# EAGLE schematic structure_right (EAGLE 9.4.2)
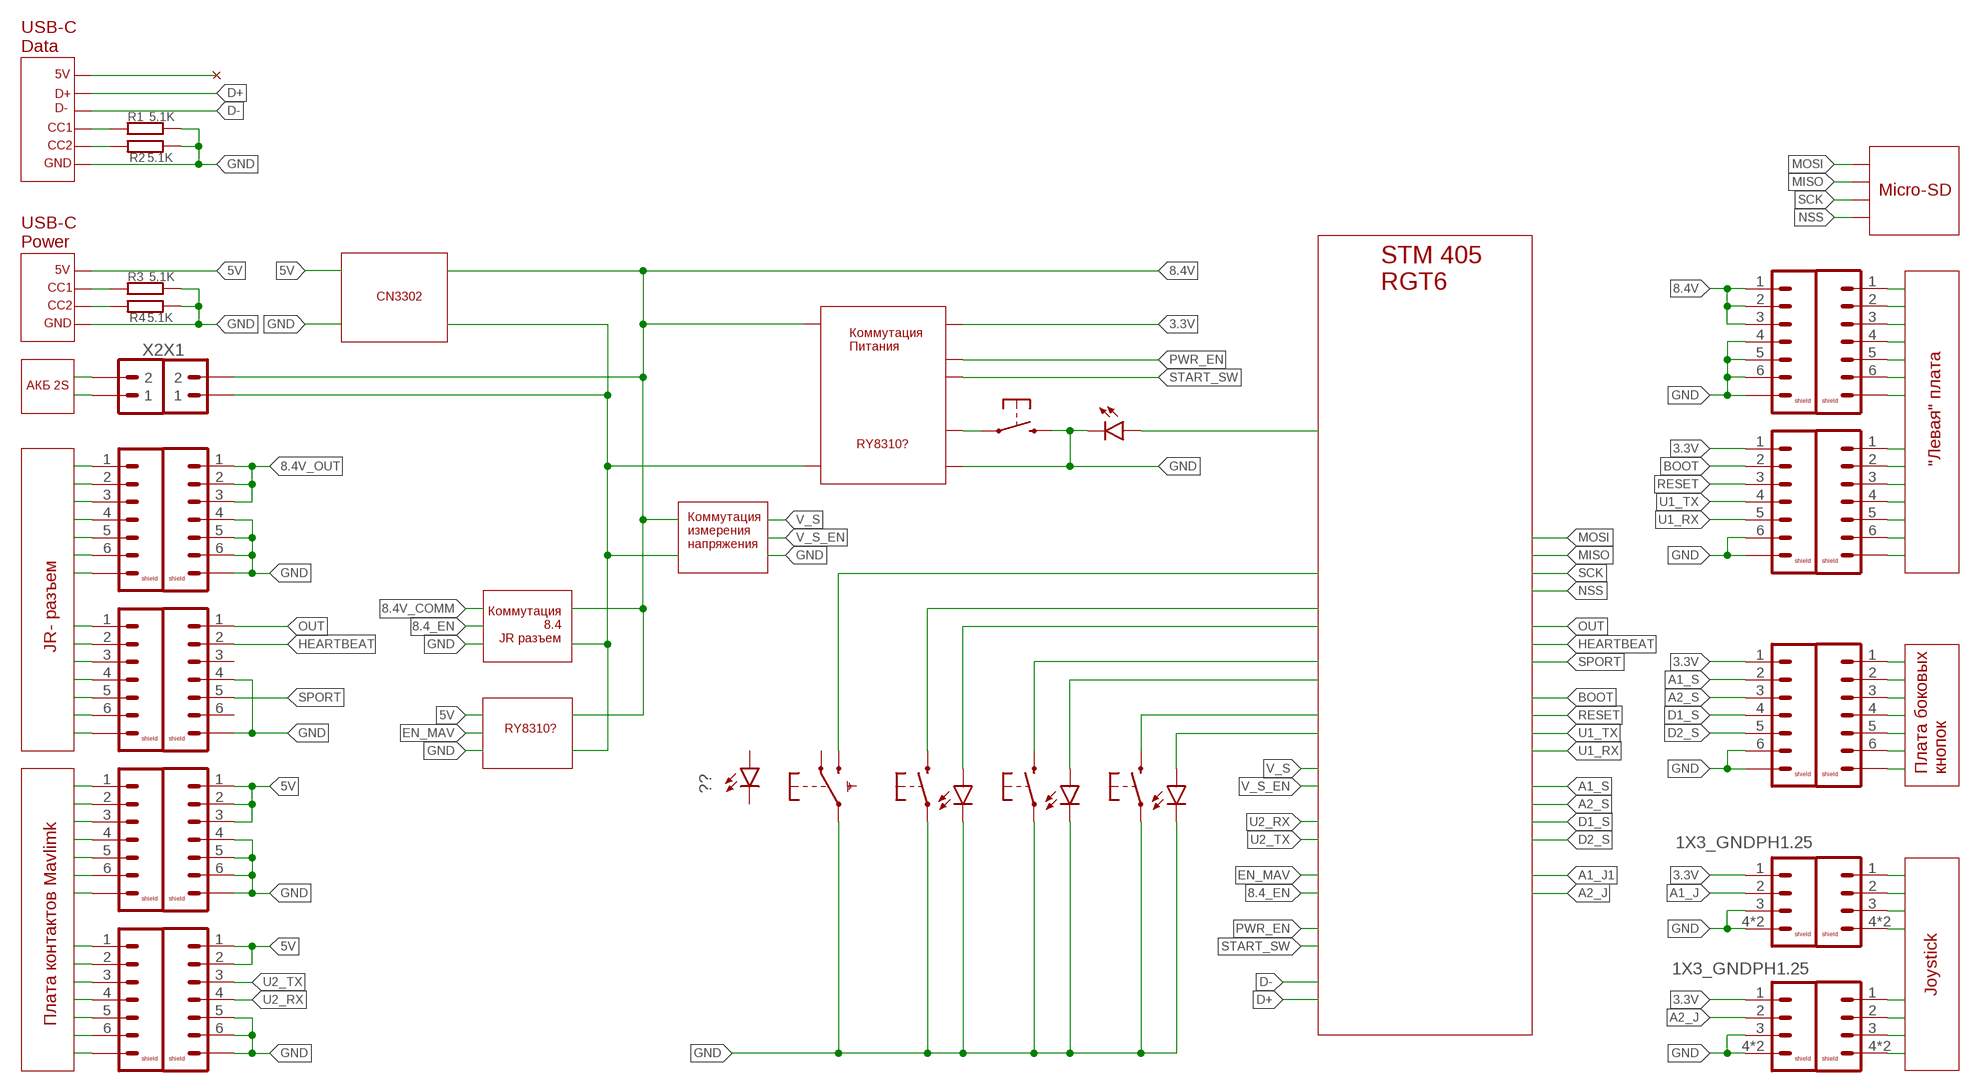
[diagram p0: schematic, sheet 1]

## Parts
LED1  LED1608  [0603]
LED2  LED1608  [0603]
LED3  LED1608  [0603]
LED5  ??  LED1608  [0603]
LED6  LED1608  [0603]
R1  5.1K  R0603_SMALL  [0603_SMALL]
R2  5.1K  R0603_SMALL  [0603_SMALL]
R3  5.1K  R0603_SMALL  [0603_SMALL]
R4  5.1K  R0603_SMALL  [0603_SMALL]
S2  BUTTON1  [3X4X2]
S3  SS12D07VG  [SS12D07VG...]
S4  BUTTON1  [3X4X2]
S5  BUTTON1  [3X4X2]
S6  BUTTON1  [3X4X2]
X1  1X2JST-XH-02  [JST-XH-02]
X2  1X2JST-XH-02  [JST-XH-02]
X3  1X6_GND  [FFC-HOLDER-1MM-6P]
X4  1X6_GND  [FFC-HOLDER-1MM-6P]
X5  1X6_GND  [FFC-HOLDER-1MM-6P]
X6  1X6_GND  [FFC-HOLDER-1MM-6P]
X7  1X6_GND  [FFC-HOLDER-1MM-6P]
X8  1X3_GNDPH1.25  1X3_GNDPH  [JST-PH-SM3-(LF)]
X9  1X3_GNDPH1.25  1X3_GNDPH  [JST-PH-SM3-(LF)]
X10  1X6_GND  [FFC-HOLDER-1MM-6P]
X11  1X6_GND  [FFC-HOLDER-1MM-6P]
X12  1X6_GND  [FFC-HOLDER-1MM-6P]
X13  1X6_GND  [FFC-HOLDER-1MM-6P]
X14  1X6_GND  [FFC-HOLDER-1MM-6P]
X15  1X6_GND  [FFC-HOLDER-1MM-6P]
X16  1X6_GND  [FFC-HOLDER-1MM-6P]
X17  1X6_GND  [FFC-HOLDER-1MM-6P]
X18  1X6_GND  [FFC-HOLDER-1MM-6P]
X19  1X3_GNDPH1.25  1X3_GNDPH  [JST-PH-SM3-(LF)]
X20  1X3_GNDPH1.25  1X3_GNDPH  [JST-PH-SM3-(LF)]

## Nets
3.3V: X4.1 X7.1 X8.1 X9.1
5V: X10.1 X10.2 X17.1 X17.2 X17.3
8.4V: X1.2 X3.1 X3.2 X3.3
8.4V_OUT: X6.1 X6.2 X6.3
A1_J: X8.2
A1_S: X7.2
A2_J: X9.2
A2_S: X7.3
BOOT: X4.2
CC1: R1.P$1
CC2: R3.P$1
D1_S: X7.4
D2_S: X7.5
GND: LED1.P$1(C) LED2.P$1(C) LED3.P$1(C) LED6.P$1(C) R1.P$2 R2.P$2 R3.P$2 R4.P$2 S2.P$1 S3.2 S4.P$1 S5.P$1 S6.P$2 X1.1 X3.4 X3.5 X3.6 X3.P$1 X3.P$2 X4.6 X4.P$1 X4.P$2 X5.4 X5.P$1 X5.P$2 X6.4 X6.5 X6.6 X6.P$1 X6.P$2 X7.6 X7.P$1 X7.P$2 X8.3 X8.4 X8.5 X9.3 X9.4 X9.5 X10.5 X10.6 X10.P$1 X10.P$2 X17.4 X17.5 X17.6 X17.P$1 X17.P$2
HEARTBEAT: X5.2
N$2: X2.2
N$3: R4.P$1
N$4: X2.1
N$5: X18.1
N$6: R2.P$1
N$7: LED1.P$2(A)
N$8: LED2.P$2(A)
N$9: LED3.P$2(A)
N$12: S2.P$2
N$14: S3.3
N$16: X18.2
N$19: X11.1
N$20: X11.2
N$21: X11.3
N$22: X11.4
N$23: X11.5
N$24: S4.P$2
N$25: S5.P$2
N$26: X11.6
N$27: X11.P$1 X11.P$2
N$28: X12.1
N$29: X12.2
N$30: X12.3
N$31: X12.4
N$32: X12.5
N$33: X12.6
N$34: X12.P$1 X12.P$2
N$35: X14.1
N$36: X14.2
N$37: X14.3
N$38: X14.4
N$39: X14.5
N$40: X14.6
N$41: X14.P$1 X14.P$2
N$42: X13.1
N$43: X13.2
N$44: X13.3
N$45: X13.4
N$46: X13.5
N$47: X13.6
N$48: X13.P$1 X13.P$2
N$49: X15.1
N$50: X15.2
N$51: X15.3
N$52: X15.4
N$53: X15.5
N$54: X15.6
N$55: X15.P$1 X15.P$2
N$56: X16.1
N$57: X16.2
N$58: X16.3
N$59: X16.4
N$60: X16.5
N$61: X16.6
N$62: X16.P$1 X16.P$2
N$63: S6.P$1
N$64: X18.3
N$65: X18.4
N$66: X18.5
N$67: X18.6
N$68: X18.P$1 X18.P$2
N$69: X19.1
N$70: X19.2
N$71: X19.3
N$72: X19.4 X19.5
N$73: X20.1
N$74: X20.2
N$75: X20.3
N$76: X20.4 X20.5
N$77: LED6.P$2(A)
OUT: X5.1
RESET: X4.3
SPORT: X5.5
U1_RX: X4.5
U1_TX: X4.4
U2_RX: X10.4
U2_TX: X10.3
Unconnected: LED5.P$1(C) LED5.P$2(A) S3.1 S3.S1 S3.S2 X5.3 X5.6

## Notes on the sheet
- USB-C
  Data
- 5V
- D+
- D-
- CC1
- CC2
- GND
- Micro-SD
- USB-C
  Power
- 5V
- STM 405
  RGT6
- CC1
- CN3302
- CC2
- GND
- Коммутация
  Питания
- АКБ 2S
- RY8310?
- "Левая" плата
- Коммутация
  измерения 
  напряжения
- JR- разъем
- Коммутация
  8.4
  JR разъем
- RY8310?
- Плата боковых
  кнопок
- Плата контактов Mavlimk
- Joystick

## Library data of the parts
LED1-LED3 LED5 LED6 = LARS_409_LED:LED
R1-R4 = LARS_409_R,C,L:R
S2 S4-S6 = LARS_409_SWITCH:BUTTON
S3 = LARS_409_SWITCH:SS12D07VG
X1 X2 = LARS_409_CONNECTORS:1X2
X3-X7 X10-X18 = LARS_409_CONNECTORS:1X6_GND
X8 X9 X19 X20 = LARS_409_CONNECTORS:1X3_GND